# Altium project PAN.PrjPCB
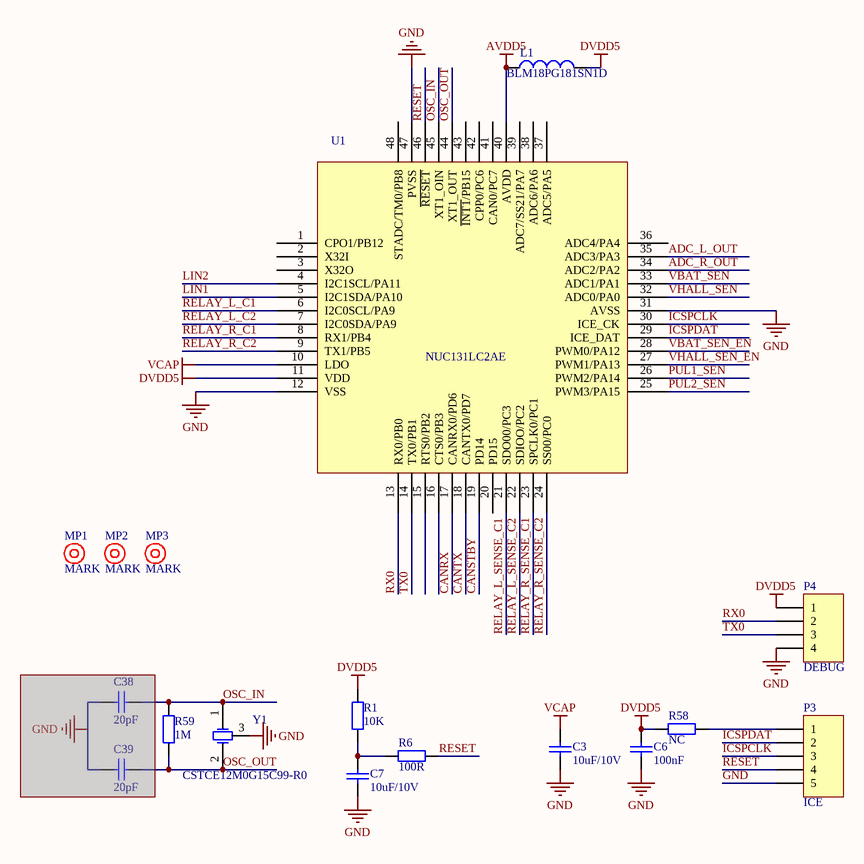
[diagram p0: MCU.SchDoc]
2 sheets, 134 parts. Net scope: global (net labels, ports and power ports of the same name join across sheets).
Board files: PAN.PcbDoc, PAN_2.PcbDoc
Sheets:
  MCU.SchDoc
  MOUDLAR.SchDoc

## Sheet MCU.SchDoc
size A4

### Parts
C3  10uF/10V  [LC-0603_C]
C6  100nF  [LC-0603_C]
C7  10uF/10V  [LC-0603_C]
C38  20pF  [LC-0603_C]
C39  20pF  [LC-0603_C]
L1  BLM18PG181SN1D  [LC-0603_L]
MP1  MARK  [MARK]
MP2  MARK  [MARK]
MP3  MARK  [MARK]
P3  ICE  [HDR1X5]
P4  DEBUG  [HDR1X4]
R1  10K  [LC-0603_R]
R6  100R  [LC-0603_R]
R58  NC  [LC-0603_R]
R59  1M  [LC-0603_R]
U1  NUC131LC2AE  [LC-LQFP-48_7x7x05P]
Y1  CSTCE12M0G15C99-R0  [SMD_8M_3]

### Nets
AVDD5: L1.1 U1.40(AVDD)
DVDD5: C6.1 L1.2 P4.1 R1.2 R58.1 U1.11(VDD)
GND: C3.2 C6.2 C7.2 P3.5 P4.4 U1.12(VSS) U1.31(AVSS) U1.47(PVSS) Y1.3(OSC3)
VCAP: C3.1 U1.10(LDO)
ADC_L_OUT: U1.35(ADC3/PA3)
ADC_R_OUT: U1.34(ADC2/PA2)
CANRX: U1.17(CANRX0/PD6)
CANSTBY: U1.19(PD14)
CANTX: U1.18(CANTX0/PD7)
ICSPCLK: P3.3 U1.30(ICE_CK)
ICSPDAT: P3.2 U1.29(ICE_DAT)
LIN1: U1.5(I2C1SDA/PA10)
LIN2: U1.4(I2C1SCL/PA11)
OSC_IN: C38.1 R59.2 U1.45(XT1_OIN) Y1.1(OSC1)
OSC_OUT: C39.1 R59.1 U1.44(XT1_OUT) Y1.2(OSC2)
PUL1_SEN: U1.26(PWM2/PA14)
PUL2_SEN: U1.25(PWM3/PA15)
RELAY_L_C1: U1.6(I2C0SCL/PA9)
RELAY_L_C2: U1.7(I2C0SDA/PA9)
RELAY_L_SENSE_C1: U1.21(SDO00/PC3)
RELAY_L_SENSE_C2: U1.22(SDIOO/PC2)
RELAY_R_C1: U1.8(RX1/PB4)
RELAY_R_C2: U1.9(TX1/PB5)
RELAY_R_SENSE_C1: U1.23(SPCLK0/PC1)
RELAY_R_SENSE_C2: U1.24(SS00/PC0)
RESET: P3.4 R6.1 U1.46(~{RESET})
RX0: P4.2 U1.13(RX0/PB0)
TX0: P4.3 U1.14(TX0/PB1)
VBAT_SEN: U1.33(ADC1/PA1)
VBAT_SEN_EN: U1.28(PWM0/PA12)
VHALL_SEN: U1.32(ADC0/PA0)
VHALL_SEN_EN: U1.27(PWM1/PA13)
NetC7_1: C7.1 R1.1 R6.2
NetP3_1: P3.1 R58.2

Not connected (* = marked no-connect by the designer): C38 2; C39 2; U1 1(CPO1/PB12) 2(X32I) 3(X32O) 15(RTS0/PB2) 16(CTS0/PB3) 20(PD15) 36(ADC4/PA4) 37(ADC5/PA5) 38(ADC6/PA6) 39(ADC7/SS21/PA7) 41(CAN0/PC7) 42(CPP0/PC6) 43(~{INT1}/PB15) 48(STADC/TM0/PB8)

### Library data of the parts
C3 C6 C7 C38 C39 = 0805 6pF (6R0) 0.25pF 50V: 贴片电容; ComponentLink1Description: 供应商链接; ComponentLink1URL: http://www.szlcsc.com/product/details_68656.html; Package: 0805; Supplier: LC; SuppliersPartNumber: C67560
L1 = Inductor: Code_IEC: 1005; Value: 10mH; Published: 8-Jun-2000; LatestRevisionDate: 29-May-2009; LatestRevisionNote: IPC-7351 Footprint Added.; PackageReference: 0402-A; Publisher: Altium Limited; PackageDescription: Chip Inductor; Code_JEITA: 0402
P3 = Header 5: Header, 5-Pin; LatestRevisionDate: 17-Jul-2002; LatestRevisionNote: Re-released for DXP Platform.; Publisher: Altium Limited
P4 = Header 4: Header, 4-Pin; LatestRevisionDate: 17-Jul-2002; LatestRevisionNote: Re-released for DXP Platform.; Publisher: Altium Limited
R1 R6 R58 R59 = 0805 15KΩ (1502) 1%: 贴片电阻; ComponentLink1Description: 供应商链接; ComponentLink1URL: http://www.szlcsc.com/product/details_18163.html; Package: 0805; Supplier: LC; SuppliersPartNumber: C17475
Y1 = CSTC

## Sheet MOUDLAR.SchDoc
size A3
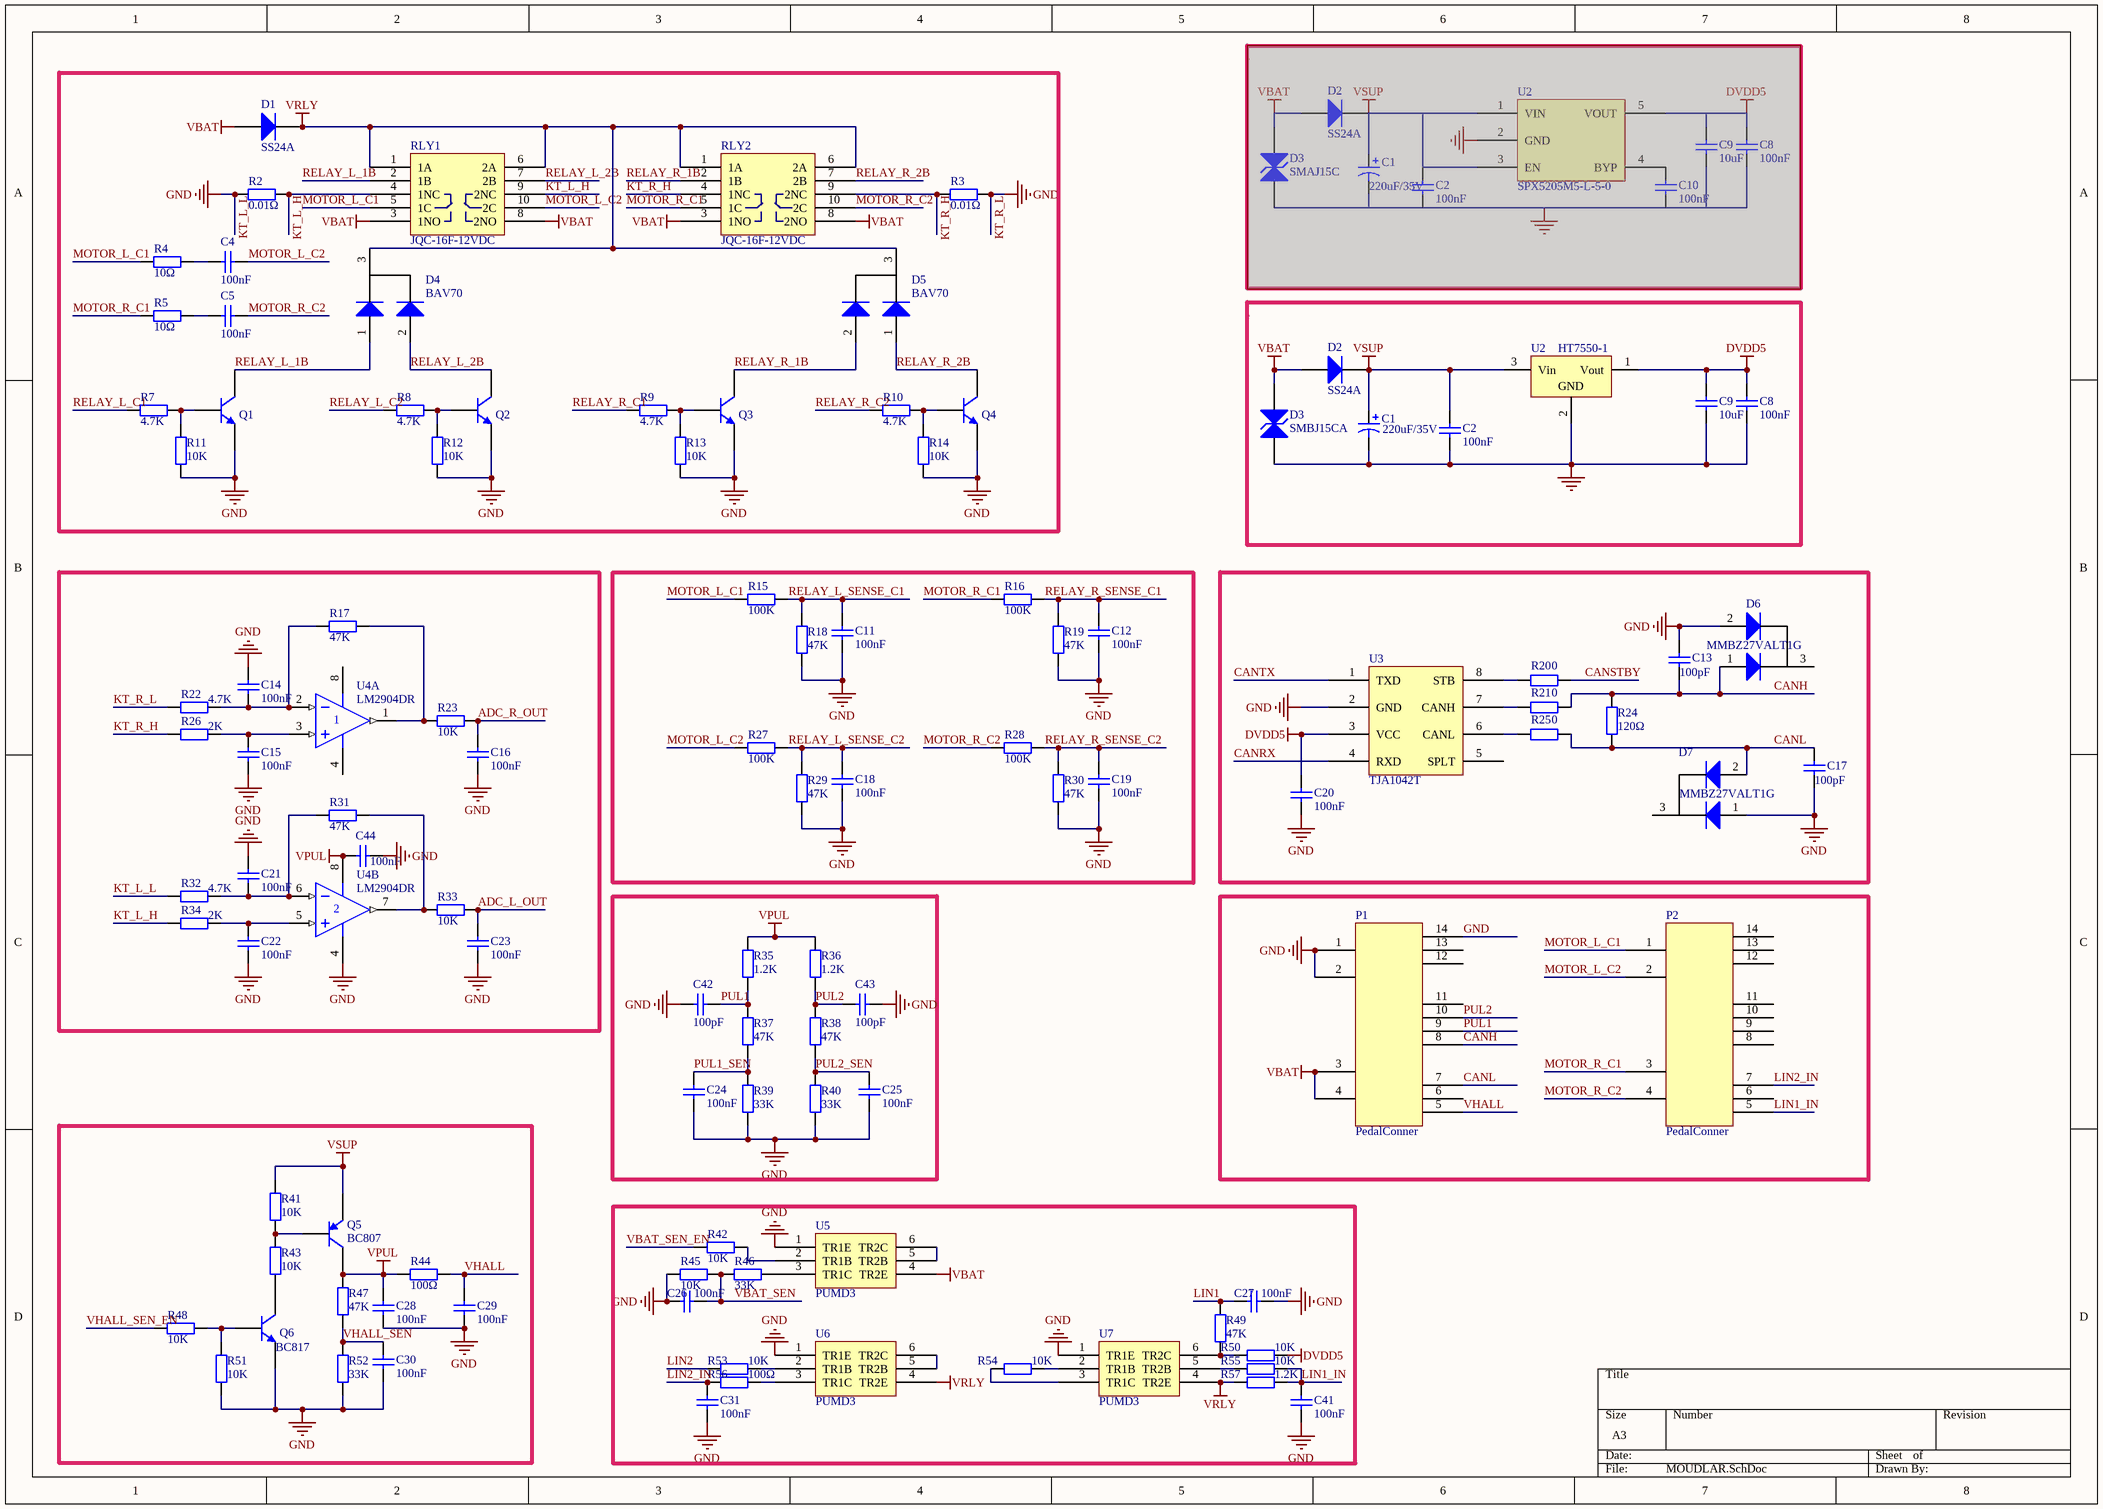
[diagram p1: MOUDLAR.SchDoc]

### Parts
(Parts that share a designator on the sheet are numbered #1, #2 ... from top to bottom, then left to right.)
C1#1  220uF/35V  [cap10x12.5]  (masked out: inside a compile mask, not in the netlist)
C1#2  220uF/35V  [cap10x12.5]
C2#1  100nF  [LC-0603_C]  (masked out: inside a compile mask, not in the netlist)
C2#2  100nF  [LC-0603_C]
C4  100nF  [LC-1210_C]
C5  100nF  [LC-1210_C]
C8#1  100nF  [LC-0603_C]  (masked out: inside a compile mask, not in the netlist)
C8#2  100nF  [LC-0603_C]
C9#1  10uF  [LC-CASE-B_3528]  (masked out: inside a compile mask, not in the netlist)
C9#2  10uF  [LC-CASE-B_3528]
C10  100nF  [LC-0603_C]  (masked out: inside a compile mask, not in the netlist)
C11  100nF  [LC-0603_C]
C12  100nF  [LC-0603_C]
C13  100pF  [LC-0603_C]
C14  100nF  [LC-0603_C]
C15  100nF  [LC-0603_C]
C16  100nF  [LC-0603_C]
C17  100pF  [LC-0603_C]
C18  100nF  [LC-0603_C]
C19  100nF  [LC-0603_C]
C20  100nF  [LC-0603_C]
C21  100nF  [LC-0603_C]
C22  100nF  [LC-0603_C]
C23  100nF  [LC-0603_C]
C24  100nF  [LC-0603_C]
C25  100nF  [LC-0603_C]
C26  100nF  [LC-0603_C]
C27  100nF  [LC-0603_C]
C28  100nF  [LC-0603_C]
C29  100nF  [LC-0603_C]
C30  100nF  [LC-0603_C]
C31  100nF  [LC-0603_C]
C41  100nF  [LC-0603_C]
C42  100pF  [LC-0603_C]
C43  100pF  [LC-0603_C]
C44  100nF  [LC-0603_C]
D1  SS24A  [LC-SMA(DO-214AC)_S1]
D2#1  SS24A  [LC-SMA(DO-214AC)_S1]  (masked out: inside a compile mask, not in the netlist)
D2#2  SS24A  [LC-SMA(DO-214AC)_S1]
D3#1  SMAJ15C  [LC-SMA(DO-214AC)_S1]  (masked out: inside a compile mask, not in the netlist)
D3#2  SMBJ15CA  [LC-SMB(DO-214AA)_S1]
D4  BAV70  [LC-SOT-23(SOT-23-3)]
D5  BAV70  [LC-SOT-23(SOT-23-3)]
D6  MMBZ27VALT1G  [LC-SOT-23(SOT-23-3)]
D7  MMBZ27VALT1G  [LC-SOT-23(SOT-23-3)]
P1  PedalConner  [padel_con]
P2  PedalConner  [padel_con]
Q1  BC817  [LC-SOT-23(SOT-23-3)]  (value not drawn)
Q2  BC817  [LC-SOT-23(SOT-23-3)]  (value not drawn)
Q3  BC817  [LC-SOT-23(SOT-23-3)]  (value not drawn)
Q4  BC817  [LC-SOT-23(SOT-23-3)]  (value not drawn)
Q5  BC807  [LC-SOT-23(SOT-23-3)]
Q6  BC817  [LC-SOT-23(SOT-23-3)]
R2  0.01Ω  [LC-2512_R]
R3  0.01Ω  [LC-2512_R]
R4  10Ω  [LC-1206_R]
R5  10Ω  [LC-1206_R]
R7  4.7K  [LC-0603_R]
R8  4.7K  [LC-0603_R]
R9  4.7K  [LC-0603_R]
R10  4.7K  [LC-0603_R]
R11  10K  [LC-0603_R]
R12  10K  [LC-0603_R]
R13  10K  [LC-0603_R]
R14  10K  [LC-0603_R]
R15  100K  [LC-0603_R]
R16  100K  [LC-0603_R]
R17  47K  [LC-0603_R]
R18  47K  [LC-0603_R]
R19  47K  [LC-0603_R]
R20  0  [LC-0603_R]
R21  0  [LC-0603_R]
R22  4.7K  [LC-0603_R]
R23  10K  [LC-0603_R]
R24  120Ω  [LC-1206_R]
R25  0  [LC-0603_R]
R26  2K  [LC-0603_R]
R27  100K  [LC-0603_R]
R28  100K  [LC-0603_R]
R29  47K  [LC-0603_R]
R30  47K  [LC-0603_R]
R31  47K  [LC-0603_R]
R32  4.7K  [LC-0603_R]
R33  10K  [LC-0603_R]
R34  2K  [LC-0603_R]
R35  1.2K  [LC-1206_R]
R36  1.2K  [LC-1206_R]
R37  47K  [LC-0603_R]
R38  47K  [LC-0603_R]
R39  33K  [LC-0603_R]
R40  33K  [LC-0603_R]
R41  10K  [LC-0603_R]
R42  10K  [LC-0603_R]
R43  10K  [LC-0603_R]
R44  100Ω  [LC-2010_R]
R45  10K  [LC-0603_R]
R46  33K  [LC-0603_R]
R47  47K  [LC-0603_R]
R48  10K  [LC-0603_R]
R49  47K  [LC-0603_R]
R50  10K  [LC-0603_R]
R51  10K  [LC-0603_R]
R52  33K  [LC-0603_R]
R53  10K  [LC-0603_R]
R54  10K  [LC-0603_R]
R55  10K  [LC-0603_R]
R56  100Ω  [LC-2010_R]
R57  1.2K  [LC-1206_R]
RLY1  JQC-16F-12VDC  [HFKA]
RLY2  JQC-16F-12VDC  [HFKA]
U2#1  SPX5205M5-L-5-0  [LC-SOT-23-5]  (masked out: inside a compile mask, not in the netlist)
U2#2  HT7550-1  [LC-SOT-89(SOT-89-3)]
U3  TJA1042T  [LC-SOIC-8_150mil]
U4  LM2904DR  [LC-SOIC-8_150mil]  (parts A,B of 2)
U5  PUMD3  [LC-SOT-363]
U6  PUMD3  [LC-SOT-363]
U7  PUMD3  [LC-SOT-363]

### Nets
DVDD5: C8#2.2 C9#2.2 C20.1 R50.1 U2#2.1(Vout) U3.3(VCC)
GND: C1#2.2 C2#2.1 C8#2.1 C9#2.1 C11.2 C12.2 C13.1 C14.2 C15.1 C16.2 C17.2 C18.2 C19.2 C20.2 C21.2 C22.1 C23.2 C24.2 C25.2 C26.2 C27.2 C28.2 C29.2 C30.2 C31.2 C41.2 C42.1 C43.2 C44.2 D3#2.2(K) D6.2(A) D7.1(A) P1.1 P1.2 P1.14 Q1.2(E) Q2.2(E) Q3.2(E) Q4.2(E) Q6.2(E) R2.2 R3.1 R11.1 R12.1 R13.1 R14.1 R18.1 R19.1 R22.1 R29.1 R30.1 R32.1 R39.1 R40.1 R45.1 R51.2 R52.1 U2#2.2(GND) U3.2(GND) U4.4(V-) U5.1(TR1E) U6.1(TR1E) U7.1(TR1E)  [also labelled KT_L_L, KT_R_L]
VBAT: D1.1(A) D2#2.1(A) D3#2.1(A) P1.3 P1.4 RLY1.3(1NO) RLY1.8(2NO) RLY2.3(1NO) RLY2.8(2NO) U5.4(TR2E)
VPUL: C28.1 C44.1 Q5.3(C) R35.2 R36.2 R44.1 R47.2 U4.8(V+)
VRLY: D1.2(K) D4.3(K) D5.3(K) R57.1 RLY1.1(1A) RLY1.6(2A) RLY2.1(1A) RLY2.6(2A) U6.4(TR2E) U7.4(TR2E)
VSUP: C1#2.1 C2#2.2 D2#2.2(K) Q5.2(E) R41.1 U2#2.3(Vin)
ADC_L_OUT: C23.1 R33.2
ADC_R_OUT: C16.1 R23.2
CANH: C13.2 D6.1(A) P1.8 R21.2 R24.2
CANL: C17.1 D7.2(A) P1.7 R24.1 R25.2
CANRX: U3.4(RXD)
CANSTBY: R20.2
CANTX: U3.1(TXD)
KT_L_H: R2.1 R34.1 RLY1.4(1NC) RLY1.9(2NC)
KT_R_H: R3.2 R26.1 RLY2.4(1NC) RLY2.9(2NC)
LIN1: C27.1 R49.1
LIN1_IN: C41.1 P2.5 R55.2 R57.2
LIN2: R53.1
LIN2_IN: C31.1 P2.7 R56.1
MOTOR_L_C1: P2.1 R4.2 R15.1 RLY1.5(1C)
MOTOR_L_C2: C4.1 P2.2 R27.1 RLY1.10(2C)
MOTOR_R_C1: P2.3 R5.2 R16.1 RLY2.5(1C)
MOTOR_R_C2: C5.1 P2.4 R28.1 RLY2.10(2C)
PUL1: C42.2 P1.9 R35.1 R37.1
PUL1_SEN: C24.1 R37.2 R39.2
PUL2: C43.1 P1.10 R36.1 R38.1
PUL2_SEN: C25.1 R38.2 R40.2
RELAY_L_1B: D4.1(A) Q1.3(C) RLY1.2(1B)
RELAY_L_2B: D4.2(A) Q2.3(C) RLY1.7(2B)
RELAY_L_C1: R7.1
RELAY_L_C2: R8.1
RELAY_L_SENSE_C1: C11.1 R15.2 R18.2
RELAY_L_SENSE_C2: C18.1 R27.2 R29.2
RELAY_R_1B: D5.2(A) Q3.3(C) RLY2.2(1B)
RELAY_R_2B: D5.1(A) Q4.3(C) RLY2.7(2B)
RELAY_R_C1: R9.1
RELAY_R_C2: R10.1
RELAY_R_SENSE_C1: C12.1 R16.2 R19.2
RELAY_R_SENSE_C2: C19.1 R28.2 R30.2
VBAT_SEN: C26.1 R45.2 R46.1
VBAT_SEN_EN: R42.1
VHALL: C29.1 P1.5 R44.2
VHALL_SEN: C30.1 R47.1 R52.2
VHALL_SEN_EN: R48.2
NetC4_2: C4.2 R4.1
NetC5_2: C5.2 R5.1
NetC14_1: C14.1 R17.1 R22.2 U4.2(IN-)
NetC15_2: C15.2 R26.2 U4.3(IN+)
NetC21_1: C21.1 R31.1 R32.2 U4.6(IN-)
NetC22_2: C22.2 R34.2 U4.5(IN+)
NetQ1_1: Q1.1(B) R7.2 R11.2
NetQ2_1: Q2.1(B) R8.2 R12.2
NetQ3_1: Q3.1(B) R9.2 R13.2
NetQ4_1: Q4.1(B) R10.2 R14.2
NetQ5_1: Q5.1(B) R41.2 R43.1
NetQ6_1: Q6.1(B) R48.1 R51.1
NetQ6_3: Q6.3(C) R43.2
NetR17_2: R17.2 R23.1 U4.1(OUT)
NetR20_1: R20.1 U3.8(STB)
NetR21_1: R21.1 U3.7(CANH)
NetR25_1: R25.1 U3.6(CANL)
NetR31_2: R31.2 R33.1 U4.7(OUT)
NetR42_2: R42.2 U5.2(TR1B)
NetR46_2: R46.2 U5.3(TR1C)
NetR49_2: R49.2 R50.2 U7.6(TR2C)
NetR53_2: R53.2 U6.2(TR1B)
NetR54_1: R54.1 U7.3(TR1C)
NetR54_2: R54.2 U7.2(TR1B)
NetR55_1: R55.1 U7.5(TR2B)
NetR56_2: R56.2 U6.3(TR1C)
NetU5_5: U5.5(TR2B) U5.6(TR2C)
NetU6_5: U6.5(TR2B) U6.6(TR2C)

Not connected (* = marked no-connect by the designer): D6 3(K); D7 3(K); P1 6 11 12 13; P2 6 8 9 10 11 12 13 14; U3 5(SPLT)

### Library data of the parts
C1#1 C1#2 = Cap Pol1: Polarized Capacitor (Radial); Published: 8-Jun-2000; LatestRevisionDate: 17-Jul-2002; LatestRevisionNote: Re-released for DXP Platform.; PackageReference: RB7.6-15; Publisher: Altium Limited; PackageDescription: Polarized Capacitor (Radial); 2 Leads
C2#1 C2#2 C4 C5 C8#1 C8#2 C9#1 C9#2 C10-C31 C41-C44 = 0805 6pF (6R0) 0.25pF 50V: 贴片电容; ComponentLink1Description: 供应商链接; ComponentLink1URL: http://www.szlcsc.com/product/details_68656.html; Package: 0805; Supplier: LC; SuppliersPartNumber: C67560
D1 D2#1 D2#2 = SMA(DO-214AC) SS54: 二极管; ComponentLink1Description: 供应商链接; ComponentLink1URL: http://www.szlcsc.com/product/details_23178.html; Package: SMA(DO-214AC); Supplier: LC; SuppliersPartNumber: C22452
D3#1 D3#2 = SMB/DO-214AA P6SMB6.8CA: TVS; pin to pad: 1>2 2>1; ComponentLink1Description: 供应商链接; ComponentLink1URL: http://www.szlcsc.com/product/details_79530.html; Package: SMB/DO-214AA; Supplier: LC; SuppliersPartNumber: C78395
D4-D7 = SOT-23 BAV70 A4: 开关二极管; ComponentLink1Description: 供应商链接; ComponentLink1URL: http://www.szlcsc.com/product/details_70091.html; Package: SOT-23; Supplier: LC; SuppliersPartNumber: C68978
Q1-Q4 Q6 = SOT-23 SS8050 Y1: 三极管; ComponentLink1Description: 供应商链接; ComponentLink1URL: http://www.szlcsc.com/product/details_2507.html; Package: SOT-23; Supplier: LC; SuppliersPartNumber: C2150
Q5 = SOT-23 SS8550 Y2: 三极管; ComponentLink1Description: 供应商链接; ComponentLink1URL: http://www.szlcsc.com/product/details_9037.html; Package: SOT-23; Supplier: LC; SuppliersPartNumber: C8542
R2-R5 R7-R57 = 0805 15KΩ (1502) 1%: 贴片电阻; ComponentLink1Description: 供应商链接; ComponentLink1URL: http://www.szlcsc.com/product/details_18163.html; Package: 0805; Supplier: LC; SuppliersPartNumber: C17475
U2#1 = SPX3819M5-L-3.3
U2#2 = SOT-89 78L05G-AB3-R: 低压差线性稳压(LDO); pin to pad: 1>3 2>1 3>2; ComponentLink1Description: 供应商链接; ComponentLink1URL: http://www.szlcsc.com/product/details_72235.html; Package: SOT-89; Supplier: LC; SuppliersPartNumber: C71136
U3 = TJA1042
U4 = LM2904DR2G: 运放; ComponentLink1Description: 供应商链接; ComponentLink1URL: http://www.szlcsc.com/product/details_18922.html; Package: SOIC-8_150mil; Supplier: LC; SuppliersPartNumber: C18229

## Nets that join several sheets
DVDD5: MCU (6 pins), MOUDLAR (6 pins)
GND: MCU (9 pins), MOUDLAR (63 pins)
ADC_L_OUT: MCU (U1.35), MOUDLAR (C23.1 R33.2)
ADC_R_OUT: MCU (U1.34), MOUDLAR (C16.1 R23.2)
CANRX: MCU (U1.17), MOUDLAR (U3.4)
CANSTBY: MCU (U1.19), MOUDLAR (R20.2)
CANTX: MCU (U1.18), MOUDLAR (U3.1)
LIN1: MCU (U1.5), MOUDLAR (C27.1 R49.1)
LIN2: MCU (U1.4), MOUDLAR (R53.1)
PUL1_SEN: MCU (U1.26), MOUDLAR (C24.1 R37.2 R39.2)
PUL2_SEN: MCU (U1.25), MOUDLAR (C25.1 R38.2 R40.2)
RELAY_L_C1: MCU (U1.6), MOUDLAR (R7.1)
RELAY_L_C2: MCU (U1.7), MOUDLAR (R8.1)
RELAY_L_SENSE_C1: MCU (U1.21), MOUDLAR (C11.1 R15.2 R18.2)
RELAY_L_SENSE_C2: MCU (U1.22), MOUDLAR (C18.1 R27.2 R29.2)
RELAY_R_C1: MCU (U1.8), MOUDLAR (R9.1)
RELAY_R_C2: MCU (U1.9), MOUDLAR (R10.1)
RELAY_R_SENSE_C1: MCU (U1.23), MOUDLAR (C12.1 R16.2 R19.2)
RELAY_R_SENSE_C2: MCU (U1.24), MOUDLAR (C19.1 R28.2 R30.2)
VBAT_SEN: MCU (U1.33), MOUDLAR (C26.1 R45.2 R46.1)
VBAT_SEN_EN: MCU (U1.28), MOUDLAR (R42.1)
VHALL_SEN: MCU (U1.32), MOUDLAR (C30.1 R47.1 R52.2)
VHALL_SEN_EN: MCU (U1.27), MOUDLAR (R48.2)